# Altium schematic sheet Supplies.SchDoc
size A4; DocumentNumber: 2; SheetNumber: 2; SheetTotal: 4; PageSetup: Record=PageOptions|CenterHorizontal=True|CenterVertical=True|PrintScale=0.97|XCorrection=1.00|YCorrection=1.00|PrintKind=1|BorderSize=5000000|LeftOffset=0|BottomOffset=0|Orientation=2|PaperLength=2970|PaperWidth=2100|Scale=100|PaperSource=7|PrintQuality=600|MediaType=1|DitherType=10|PaperKind=A4|PrintScaleMode=1
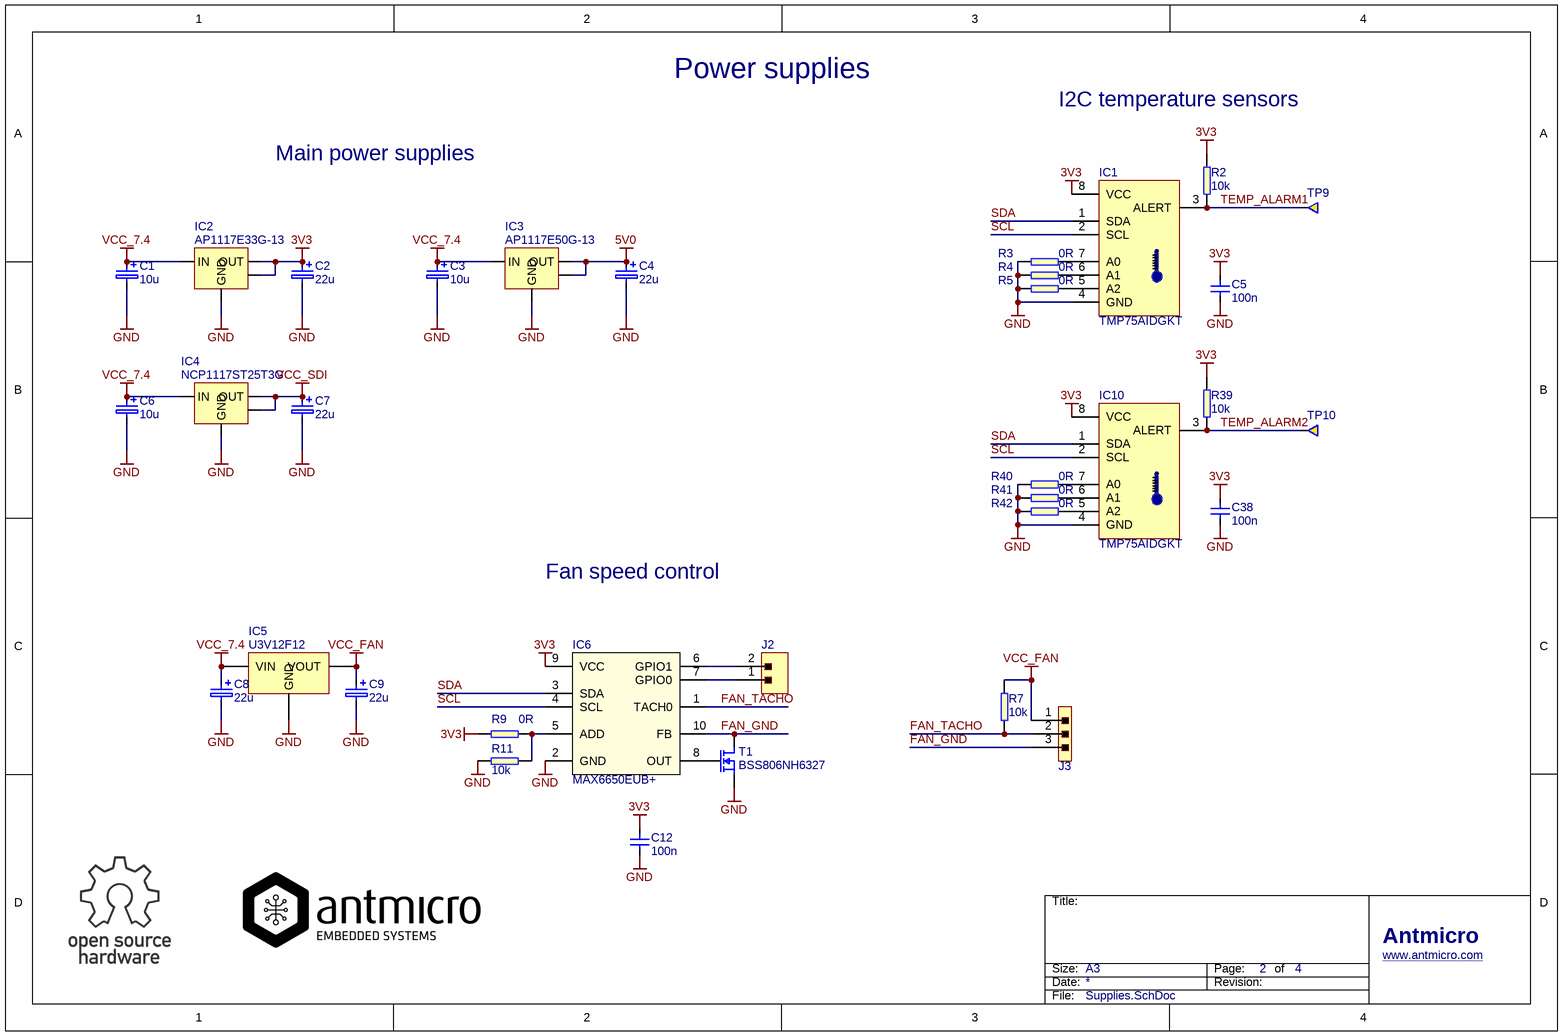
[diagram p0: Supplies.SchDoc]

## Parts
C1  10u  [KEMET_C]
C2  22u  [KEMET_C]
C3  10u  [KEMET_C]
C4  22u  [KEMET_C]
C5  100n  [0402]
C6  10u  [KEMET_C]
C7  22u  [KEMET_C]
C8  22u  [KEMET_C]
C9  22u  [KEMET_C]
C12  100n  [0402]
C38  100n  [0402]
IC1  TMP75AIDGKT  [MSOP-8]
IC2  AP1117E33G-13  [SOT223]
IC3  AP1117E50G-13  [SOT223]
IC4  NCP1117ST25T3G  [SOT223]
IC5  U3V12F12  [U3V12Fxx]
IC6  MAX6650EUB+  [uMAX10]
IC10  TMP75AIDGKT  [MSOP-8]
J2  MH_1X02_2.54  [MH_1X02_2.54]  (value not drawn)
J3  Molex 022232031  [molex_2223-2031]  (value not drawn)
R2  10k  [0402]
R3  0R  [0603]
R4  0R  [0603]
R5  0R  [0603]
R7  10k  [0402]
R9  0R  [0603]
R11  10k  [0603]
R39  10k  [0402]
R40  0R  [0603]
R41  0R  [0603]
R42  0R  [0603]
T1  BSS806NH6327  [SOT-23]
TP9  Testpad  [Testpad]  (value not drawn)  (no BOM)
TP10  Testpad  [Testpad]  (value not drawn)  (no BOM)

## Nets
3V3: C2.1 C5.1 C12.1 C38.1 IC1.8(VCC) IC2.2(OUT) IC2.4(OUT) IC6.9(VCC) IC10.8(VCC) R2.2 R9.1 R39.2
5V0: C4.1 IC3.2(OUT) IC3.4(OUT)
GND: C1.2 C2.2 C3.2 C4.2 C5.2 C6.2 C7.2 C8.2 C9.2 C12.2 C38.2 IC1.4(GND) IC2.1(GND) IC3.1(GND) IC4.1(GND) IC5.2(GND) IC6.2(GND) IC10.4(GND) R3.2 R4.2 R5.2 R11.1 R40.2 R41.2 R42.2 T1.2(S)
VCC_7.4: C1.1 C3.1 C6.1 C8.1 IC2.3(IN) IC3.3(IN) IC4.3(IN) IC5.1(VIN)
VCC_FAN: C9.1 IC5.3(VOUT) J3.1 R7.2
VCC_SDI: C7.1 IC4.2(OUT) IC4.4(OUT)
FAN_GND: IC6.10(FB) J3.3 T1.3(D)
FAN_TACHO: IC6.1(TACH0) J3.2 R7.1
SCL: IC1.2(SCL) IC6.4(SCL) IC10.2(SCL)
SDA: IC1.1(SDA) IC6.3(SDA) IC10.1(SDA)
TEMP_ALARM1: IC1.3(ALERT) R2.1 TP9.1
TEMP_ALARM2: IC10.3(ALERT) R39.1 TP10.1
NetIC1_5: IC1.5(A2) R5.1
NetIC1_6: IC1.6(A1) R4.1
NetIC1_7: IC1.7(A0) R3.1
NetIC6_5: IC6.5(ADD) R9.2 R11.2
NetIC6_6: IC6.6(GPIO1) J2.2
NetIC6_7: IC6.7(GPIO0) J2.1
NetIC6_8: IC6.8(OUT) T1.1(G)
NetIC10_5: IC10.5(A2) R42.1
NetIC10_6: IC10.6(A1) R41.1
NetIC10_7: IC10.7(A0) R40.1

## Notes on the sheet
- Power supplies
- I2C temperature sensors
- Main power supplies
- Fan speed control
- Title:
- Size:
- Date:
- A3
- Revision:
- Page:
- of
- Antmicro
- www.antmicro.com
- File:

## Library data of the parts
C1 C3 C6 = CPol_10u: Tantalum SMT Capacitor 10uF Case KEMET_C; Part Number: C_10u_KEMET_C; Manufacturer: KEMET; Part Symbol: T491C106K025AT; Value: 10u
C2 C4 C7-C9 = CPol_22u: Tantalum SMT Capacitor 22uF Case KEMET_C; Part Number: C_22u_KEMET_C; Manufacturer: KEMET; Part Symbol: T491C226K025AT; Value: 22u
C5 C12 C38 = C_100n_0402: MLCC SMT Capacitor 0402; Manufacturer: MULTICOMP; Part Symbol: MC0402X104M100CT; Value: 100n; Part Number: C_100n_0402
IC1 IC10 = TMP75: Temperature Sensor With I2C and SMBus Interface in Industry Standard LM75; Manufacturer: TEXAS INSTRUMENTS; Part Number: TMP75AIDGKT; Value: TMP75AIDGKT; Part Symbol: TMP75AIDGKT
IC2 = AP1117E33G-13: IC, LDO, REG, 3.3V, SOT223; Manufacturer: DIODES INC.; Value: AP1117E33G-13; Part Number: AP1117E33G-13; Part Symbol: AP1117E33G-13
IC3 = AP1117E50G-13: IC, LDO, REG, 5.0V, SOT223; Manufacturer: DIODES INC.; Value: AP1117E50G-13; Part Number: AP1117E50G-13; Part Symbol: AP1117E50G-13
IC4 = NCP1117ST25T3G: IC, LDO, REG, 2.5V, SOT223; Manufacturer: ON Semiconductor; Value: NCP1117ST25T3G; Part Number: NCP1117ST25T3G; Part Symbol: NCP1117ST25T3G
IC5 = U3V12F12: Pololu 9V Step-Up Voltage Regulator; Manufacturer: TME; Part Symbol: POLOLU-2117 / POLOLU-2117; Part Number: U3V12F12; Value: U3V12F12
IC6 = MAX6650: Fan-Speed Regulator and Monitor with SMBus/I2C-Compatible Interface; Manufacturer: MAXIM INTEGRATED; Part Number: MAX6650EUB+; Value: MAX6650EUB+; Part Symbol: MAX6650EUB+
J2 = 1X02: Male header, 1 x 02 pins, pitch 2.54 mm; Manufacturer: MULTICOMP; Part Symbol: 2211S-02G; Part Number: MH_1X02_2.54; Value: MH_1X02_2.54
J3 = 1X03: Part Number: molex_2223-2031; Value: Molex 022232031; Manufacturer: Molex; Part Symbol: 22-23-2031
R2 R7 R39 = R_10k_0402: SMT Resistor 0402; Manufacturer: MULTICOMP; Part Symbol: MCMR04X1002FTL; Value: 10k; Part Number: R_10k_0402
R3-R5 R9 R40-R42 = R_0R_0603: SMT Resistor 0R 0603; Manufacturer: BOURNS; Part Symbol: CR0603-J/-000ELF; Value: 0R; Part Number: R_0R_0603
R11 = R_10k_0603: SMT Resistor 0R 0603; Manufacturer: BOURNS; Part Symbol: CR0603-JW-103ELF; Value: 10k; Part Number: R_10k_0603
T1 = BSS806NH6327: MOSFET, BRT, N CH, 2.3 A, 20 V, 0.041 ohm, 2.5 V, 550 mV; Manufacturer: INFINEON; Part Symbol: BSS806NH6327XTSA1; Value: BSS806NH6327; Part Number: BSS806NH6327
TP9 TP10 = Testpad: Testpad 2mm diameter; Manufacturer: PCB ONLY; Part Number: Testpad; Part Symbol: PCB ONLY